# EAGLE design receiver2 (EAGLE 6.4)
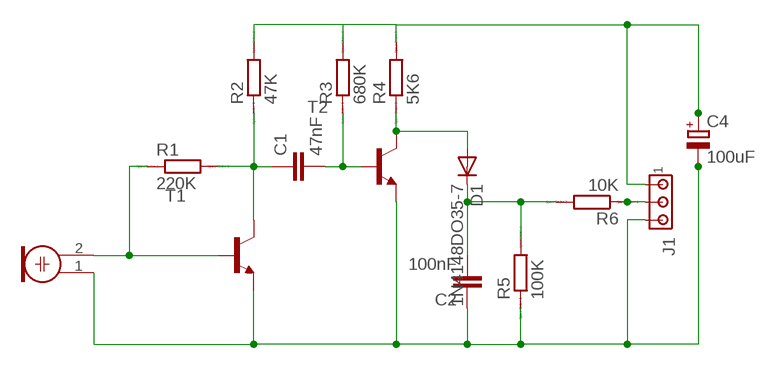
[diagram p0: schematic, sheet 1]

## Parts
C1  47nF  C2.5/2  [C2.5-2]
C2  100nF  C2.5/2  [C2.5-2]
C4  100uF  CPOL-EUB45181A  [B45181A]
D1  1N4148DO35-7  [DO35-7]
J1  MTA03-100  [10X03MTA]
M1  ELECTRET_MICROPHON-F6050AP  [F6050AP]
R1  220K  R0207/10  [0207/10]
R2  47K  R0207/10  [0207/10]
R3  680K  R0207/10  [0207/10]
R4  5K6  R0207/10  [0207/10]
R5  100K  R0207/10  [0207/10]
R6  10K  R0207/10  [0207/10]
T1  BC548-NPN-TO92-CBE  [TO92-CBE]
T2  BC548-NPN-TO92-CBE  [TO92-CBE]

## Nets
N$1: M1.2 R1.1 T1.B
N$2: C1.1 R1.2 R2.1 T1.C
N$3: C2.1 C4.- J1.3 M1.1 R5.1 T1.E T2.E
N$4: C1.2 R3.1 T2.B
N$5: D1.A R4.1 T2.C
N$6: C4.+ J1.1 R2.2 R3.2 R4.2
N$8: C2.2 D1.C R5.2 R6.2
N$10: J1.2 R6.1

## Library data of the parts
C1 C2 = capacitor-wima:C: CAPACITOR naming: grid - package width
C4 = resistor:CPOL-EU: POLARIZED CAPACITOR, European symbol
D1 = diode:1N4148: DIODE high speed (Philips)
J1 = con-amp:MTA03-100: AMP connector
M1 = microphon:ELECTRET_MICROPHON-: Electret Condenser Microphone
R1-R6 = eagle-ltspice:R: RESISTOR, European symbol; SPICEMODEL: NONE; SPICEPREFIX: R
T1 T2 = transistor:*-NPN-: NPN Transistror BF959 corrected 2008.03.06

## Board
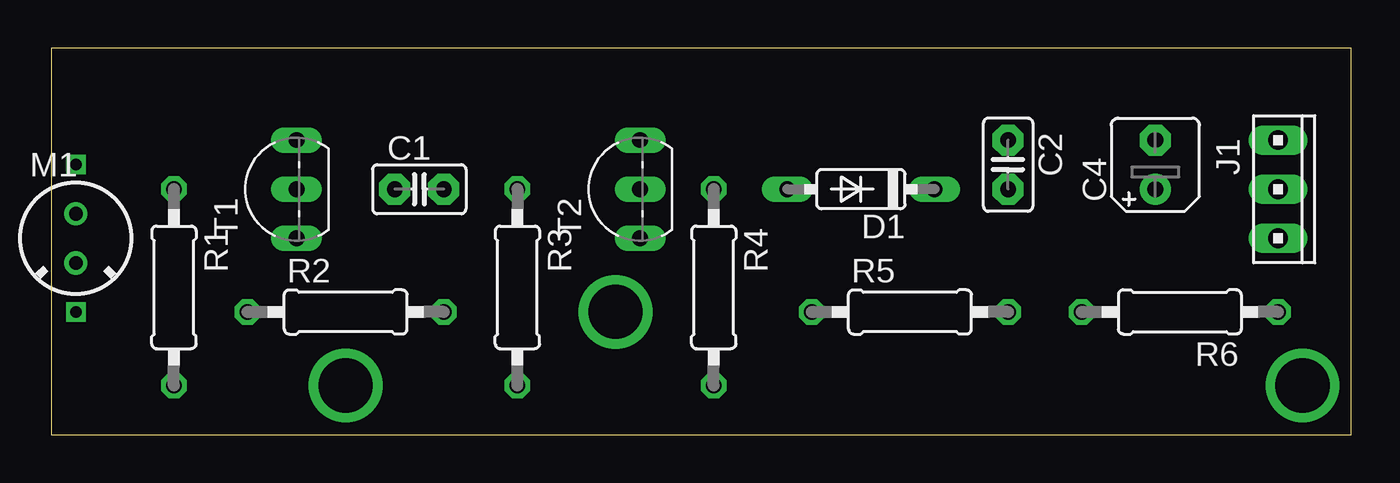
[diagram p1: board, top side]
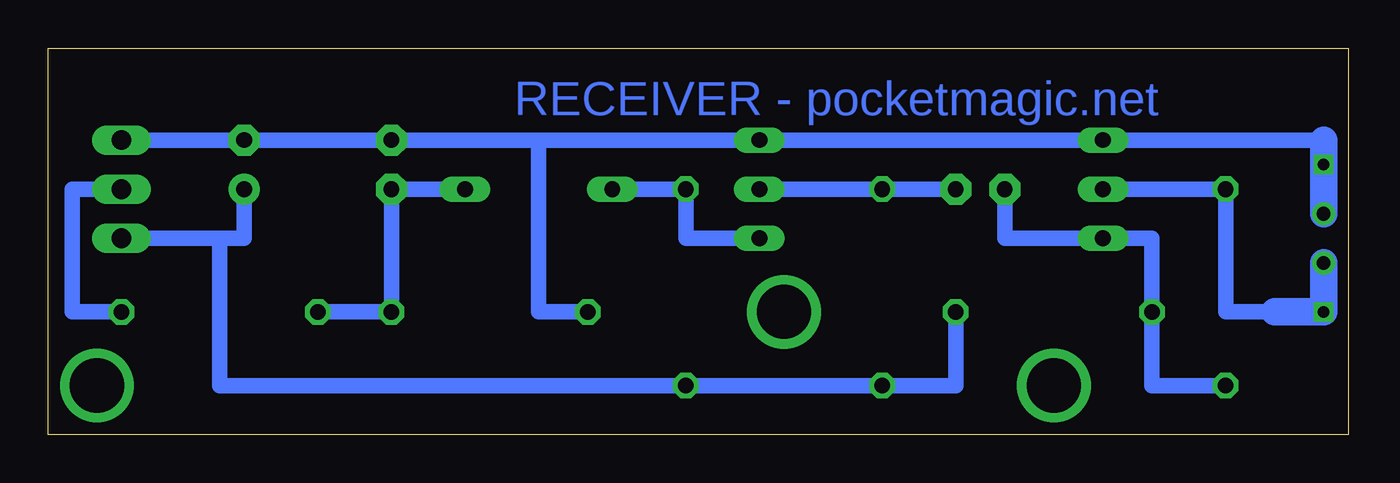
[diagram p2: board, bottom side, seen from below]

Size 67.29 x 19.99 mm. Coordinates in mm from the lower left corner, seen from the top.
Outline: 0,0 67.29,0 67.29,19.99 0,19.99 0,0
Copper layers (1*16): Top 0.035mm / dielectric 1.5mm / Bottom 0.035mm
Design rules "default *": minimum track width 10mil, minimum drill 24mil, track to track 8mil, track to pad 8mil, pad to pad 8mil, via to via 8mil, smd to smd 8mil, copper to edge 40mil, drill to drill 8mil, minimum pad ring 10mil, minimum via ring 8mil, stop-mask expansion 4mil, vias tented up to drill 0mil, thermal gap 10mil

### Footprints (pad centres in the part's own frame; a part is rotated, then mirrored left to right if it is on the bottom)
C2.5-2 = drill 0.813 pad 1.6 octagon: 1 -1.27,0; 2 1.27,0
B45181A = drill 0.813 pad 1.6: + -1.27,0 | drill 0.813 pad 1.6 octagon: - 1.27,0
DO35-7 = drill 0.813 long: A 3.81,0; C -3.81,0
10X03MTA = drill 1.016 long: 1 2.54,0; 2 0,0; 3 -2.54,0
F6050AP = drill 0.7 pad 1.2: 1 0,1.27; 2 0,-1.27
0207/10 = drill 0.813 octagon: 1 -5.08,0; 2 5.08,0
TO92-CBE = drill 0.813 long: B 0,0; C -2.54,0; E 2.54,0

### Placement (x,y rotation side)
C1  19.05,12.7 0 top
C2  49.53,13.97 270 top
C4  57.15,13.97 90 top
D1  41.91,12.7 180 top
J1  63.5,12.7 270 top
M1  1.27,10.16 0 top
R1  6.35,7.62 270 top
R2  15.24,6.35 0 top
R3  24.13,7.62 270 top
R4  34.29,7.62 270 top
R5  44.45,6.35 0 top
R6  58.42,6.35 180 top
T1  12.7,12.7 90 top
T2  30.48,12.7 90 top

### Tracks (layer width: path | path; a pad name or v marks a point on that pad's centre or on a via)
N$1
  Bottom 0.813: 3.81,6.35 6.35,6.35 R1.1 T1.B
  Bottom 1.422: M1.2 1.27,6.35 2.54,6.35 3.81,6.35
N$2
  Bottom 0.813: R1.2 10.16,2.54 R2.1 10.16,10.16 T1.C 17.78,10.16 C1.1
N$3
  Bottom 0.813: 1.27,15.24 T1.E T2.E 41.91,15.24 | 41.91,15.24 C2.1 C4.- J1.3 | R5.1 41.91,6.35 41.91,15.24
  Bottom 1.422: M1.1 1.27,13.97 1.27,15.24
N$4
  Bottom 0.813: C1.2 R3.1 T2.B
N$5
  Bottom 0.813: T2.C 34.29,10.16 R4.1 D1.A
N$6
  Bottom 0.813: R2.2 20.32,2.54 R3.2 R4.2 58.42,2.54 58.42,10.16 | 57.15,10.16 58.42,10.16 | 58.42,10.16 J1.1 | 57.15,10.16 C4.+ 57.15,10.16
N$7  (via drill 0.6)
  other vias: 1.27,13.97
N$8
  Bottom 0.813: D1.C C2.2 R5.2 R6.2
N$9  (via drill 0.6)
  other vias: 1.27,6.35
N$10
  Bottom 0.813: R6.1 66.04,6.35 66.04,12.7 J1.2
N$11  (via drill 2.8)
  other vias: 64.77,2.54
N$12  (via drill 2.8)
  other vias: 15.24,2.54
N$13  (via drill 2.8)
  other vias: 29.21,6.35

### Text on the board
Bottom: RECEIVER - pocketmagic.net